# EAGLE board riser-v2 (EAGLE 7.7.0)
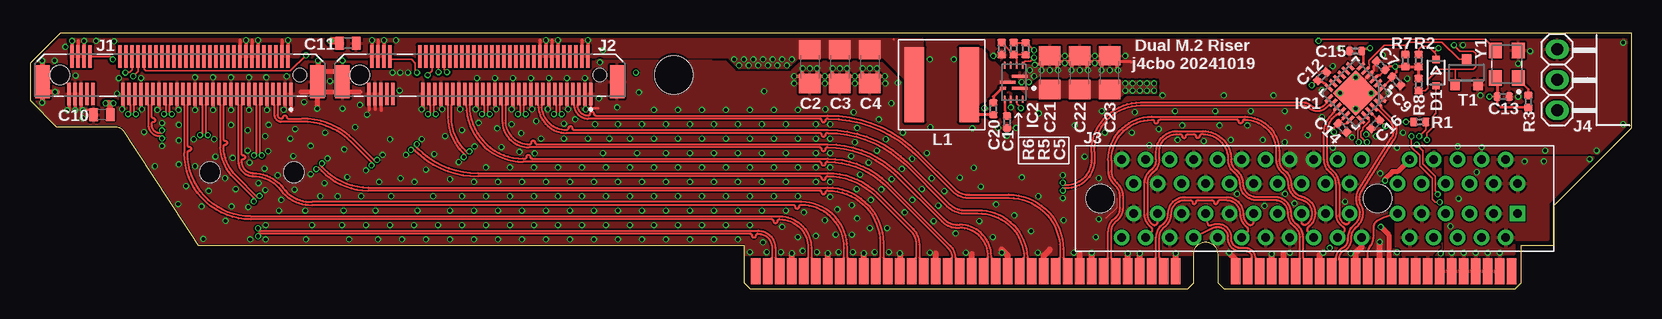
[diagram p4: board, top side]
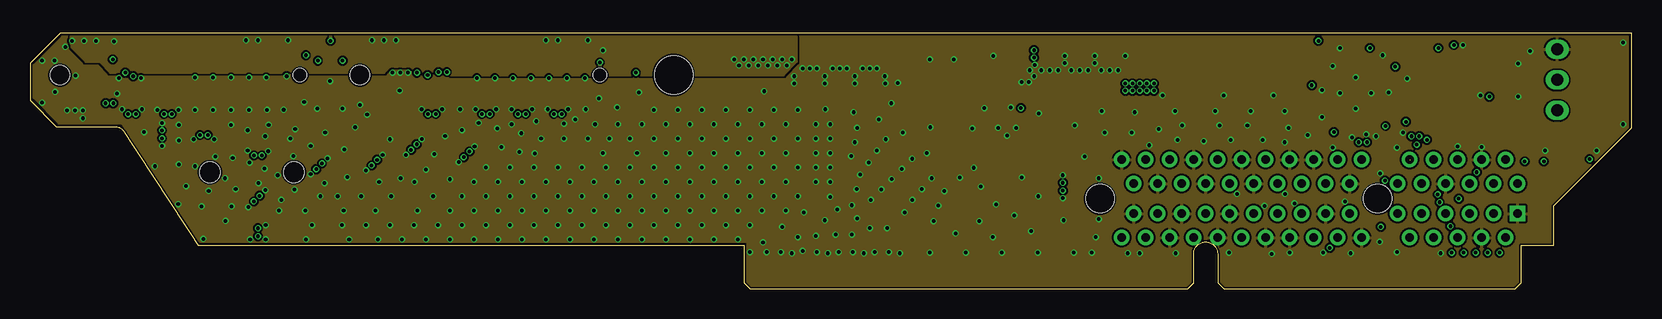
[diagram p5: board, inner layer Route2]
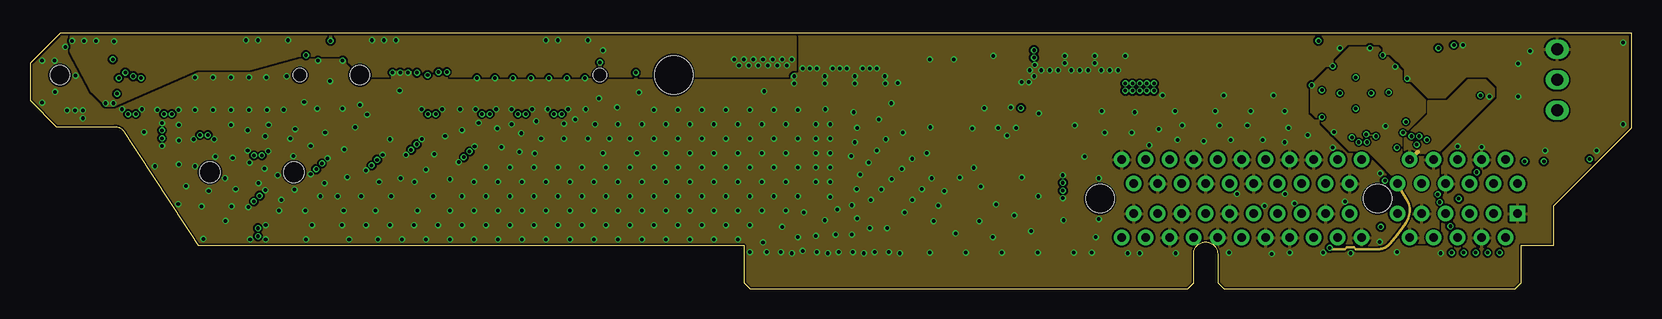
[diagram p6: board, inner layer Route15]
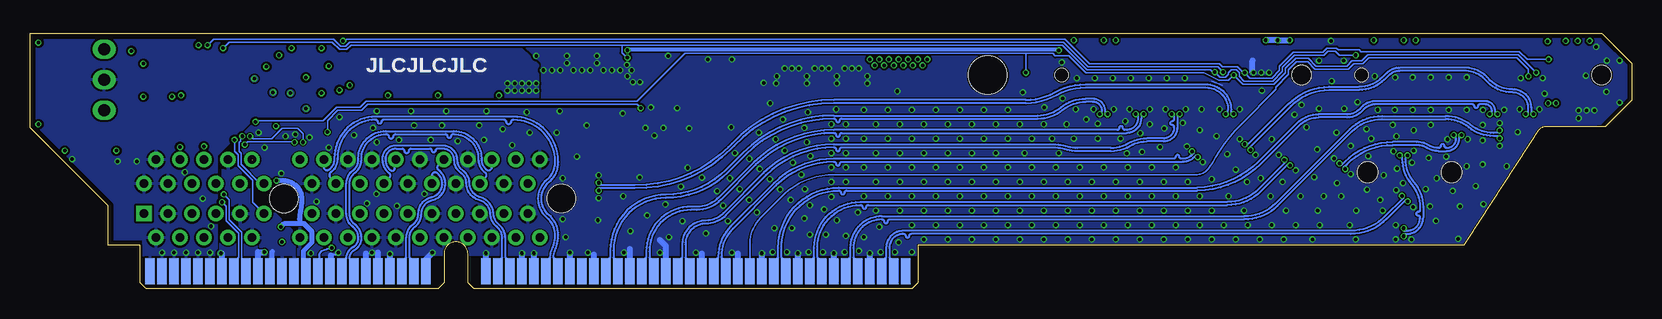
[diagram p7: board, bottom side, seen from below]

Size 133.5 x 21.3 mm. Coordinates in mm from the lower left corner, seen from the top.
Outline: 14,3.6 59.5,3.6 59.5,0.5 60,0 96.5,0 97,0.5 97,2.9 arc-90 98,3.9 arc-90 99,2.9 99,0.5 99.5,0 123.8,0 124.3,0.5 124.3,3.6 127,3.6 127,6.9 133.5,13.4 133.5,21.3 2.5,21.3 0,18.8 0,15.7 2.2,13.5 7.1,13.5 arc-60 7.9,13 14,3.6
Copper layers (1+2*15+16): Top 0.035mm / dielectric 0.2mm / Route2 0.035mm / dielectric 0.15mm / Route15 0.035mm / dielectric 0.2mm / Bottom 0.035mm
Design rules "default *": minimum track width 3.5mil, minimum drill 0.3mm, track to track 4mil, track to pad 4mil, pad to pad 4mil, via to via 4mil, smd to smd 0.05mm, copper to edge 0.1mm, drill to drill 8mil, minimum pad ring 0.3mm, minimum via ring 0.1mm, stop-mask expansion 0.03048125mm, vias tented up to drill 20mil, thermal gap 7mil
Net classes: 1 pcie: width 0.158 mm, clearance 0.102 mm
Holes 3.2 mm at 53.65,17.8
Holes 1.7 mm at 22,9.7 15,9.7

## Footprints (pad centres in the part's own frame; a part is rotated, then mirrored left to right if it is on the bottom)
C0402 = smd 0.6 x 0.7: 1 -0.5,0; 2 0.5,0
C1206 = smd 1.6 x 1.8: 1 -1.4,0; 2 1.4,0
C0603 = smd 0.8 x 1.1: 1 -0.7,0; 2 0.7,0
SOD323-R = smd 0.6 x 0.6: A 1.1,0; C -1.1,0
QFN24_4X4_SIL = smd 0.813 x 0.254: 1 -1.892,1.25; 2 -1.892,0.75; 3 -1.892,0.25; 4 -1.892,-0.25; 5 -1.892,-0.75; 6 -1.892,-1.25; 13 1.892,-1.25; 14 1.892,-0.75; 15 1.892,-0.25; 16 1.892,0.25; 17 1.892,0.75; 18 1.892,1.25 | smd 0.254 x 0.813: 7 -1.25,-1.892; 8 -0.75,-1.892; 9 -0.25,-1.892; 10 0.25,-1.892; 11 0.75,-1.892; 12 1.25,-1.892; 19 1.25,1.892; 20 0.75,1.892; 21 0.25,1.892; 22 -0.25,1.892; 23 -0.75,1.892; 24 -1.25,1.892 | smd 2.692 x 2.692: 25 0,0
VREG_TPS51386RJNR = smd 1.4 x 0.25: 1 -0.5,0.5; 2 -0.5,-0.5; 7 0.5,0 | smd 0.25 x 0.6: 3 -0.75,-1.4; 4 -0.25,-1.4; 5 0.25,-1.4; 6 0.75,-1.4; 9 0.75,1.4; 10 0.25,1.4; 11 -0.25,1.4; 12 -0.75,1.4 | smd 0.6 x 0.25: 8 0.9,0.5
MDT350M01001VT_EXT = smd 0.3 x 1.875: 1 9.25,-1.562; 2 9,1.562; 3 8.75,-1.562; 4 8.5,1.562; 5 8.25,-1.562; 6 8,1.562; 7 7.75,-1.562; 8 7.5,1.562; 9 7.25,-1.562; 10 7,1.562; 11 6.75,-1.562; 12 6.5,1.562; 13 6.25,-1.562; 14 6,1.562; 15 5.75,-1.562; 16 5.5,1.562; 17 5.25,-1.562; 18 5,1.562; 19 4.75,-1.562; 20 4.5,1.562; 21 4.25,-1.562; 22 4,1.562; 23 3.75,-1.562; 24 3.5,1.562; 25 3.25,-1.562; 26 3,1.562; 27 2.75,-1.562; 28 2.5,1.562; 29 2.25,-1.562; 30 2,1.562; 31 1.75,-1.562; 32 1.5,1.562; 33 1.25,-1.562; 34 1,1.562; 35 0.75,-1.562; 36 0.5,1.562; 37 0.25,-1.562; 38 0,1.562; 39 -0.25,-1.562; 40 -0.5,1.562; 41 -0.75,-1.562; 42 -1,1.562; 43 -1.25,-1.562; 44 -1.5,1.562; 45 -1.75,-1.562; 46 -2,1.562; 47 -2.25,-1.562; 48 -2.5,1.562; 49 -2.75,-1.562; 50 -3,1.562; 51 -3.25,-1.562; 52 -3.5,1.562; 53 -3.75,-1.562; 54 -4,1.562; 55 -4.25,-1.562; 56 -4.5,1.562; 57 -4.75,-1.562; 58 -5,1.562; 67 -7.25,-1.562; 68 -7.5,1.562; 69 -7.75,-1.562; 70 -8,1.562; 71 -8.25,-1.562; 72 -8.5,1.562; 73 -8.75,-1.562; 74 -9,1.562; 75 -9.25,-1.562 | smd 1.2 x 2.75: S1 -11.45,-0.55; S2 11.45,-0.55 | hole 1.1: 10,0 | hole 1.6: -10,0
PCI-E-X4 = drill 0.7 pad 1.27 square: A1 -17,1.25 | drill 0.7 pad 1.27: A2 -16,3.25; A3 -15,1.25; A4 -14,3.25; A5 -13,1.25; A6 -12,3.25; A7 -11,1.25; A8 -10,3.25; A9 -9,1.25; A10 -8,3.25; A11 -7,1.25; A12 -4,3.25; A13 -3,1.25; A14 -2,3.25; A15 -1,1.25; A16 0,3.25; A17 1,1.25; A18 2,3.25; A19 3,1.25; A20 4,3.25; A21 5,1.25; A22 6,3.25; A23 7,1.25; A24 8,3.25; A25 9,1.25; A26 10,3.25; A27 11,1.25; A28 12,3.25; A29 13,1.25; A30 14,3.25; A31 15,1.25; A32 16,3.25; B1 -17,-1.25; B2 -16,-3.25; B3 -15,-1.25; B4 -14,-3.25; B5 -13,-1.25; B6 -12,-3.25; B7 -11,-1.25; B8 -10,-3.25; B9 -9,-1.25; B10 -8,-3.25; B11 -7,-1.25; B12 -4,-3.25; B13 -3,-1.25; B14 -2,-3.25; B15 -1,-1.25; B16 0,-3.25; B17 1,-1.25; B18 2,-3.25; B19 3,-1.25; B20 4,-3.25; B21 5,-1.25; B22 6,-3.25; B23 7,-1.25; B24 8,-3.25; B25 9,-1.25; B26 10,-3.25; B27 11,-1.25; B28 12,-3.25; B29 13,-1.25; B30 14,-3.25; B31 15,-1.25; B32 16,-3.25 | hole 2.35: -5.35,0; 17.8,0
1X03 = drill 1.016 long: 1 -2.54,0; 2 0,0; 3 2.54,0
ADDR0262-EDGE = smd 0.8 x 2.2: A1 1,1.1; A2 2,1.1; A3 3,1.1; A4 4,1.1; A5 5,1.1; A6 6,1.1; A7 7,1.1; A8 8,1.1; A9 9,1.1; A10 10,1.1; A11 11,1.1; A12 12,1.1; A13 13,1.1; A14 14,1.1; A15 15,1.1; A16 16,1.1; A17 17,1.1; A18 18,1.1; A19 19,1.1; A20 20,1.1; A21 21,1.1; A22 22,1.1; A23 23,1.1; A24 24,1.1; A25 25,1.1; A26 26,1.1; A27 27,1.1; A28 28,1.1; A29 29,1.1; A30 30,1.1; A31 31,1.1; A32 32,1.1; A33 33,1.1; A34 34,1.1; A35 35,1.1; A36 36,1.1; A37 41,1.1; A38 42,1.1; A39 43,1.1; A40 44,1.1; A41 45,1.1; A42 46,1.1; A43 47,1.1; A44 48,1.1; A45 49,1.1; A46 50,1.1; A47 51,1.1; A48 52,1.1; A49 53,1.1; A50 54,1.1; A51 55,1.1; A52 56,1.1; A53 57,1.1; A54 58,1.1; A55 59,1.1; A56 60,1.1; A57 61,1.1; A58 62,1.1; A59 63,1.1; A60 64,1.1 | smd 0.8 x 2.2 bottom: B1 1,1.1; B2 2,1.1; B3 3,1.1; B4 4,1.1; B5 5,1.1; B6 6,1.1; B7 7,1.1; B8 8,1.1; B9 9,1.1; B10 10,1.1; B11 11,1.1; B12 12,1.1; B13 13,1.1; B14 14,1.1; B15 15,1.1; B16 16,1.1; B17 17,1.1; B18 18,1.1; B19 19,1.1; B20 20,1.1; B21 21,1.1; B22 22,1.1; B23 23,1.1; B24 24,1.1; B25 25,1.1; B26 26,1.1; B27 27,1.1; B28 28,1.1; B29 29,1.1; B30 30,1.1; B31 31,1.1; B32 32,1.1; B33 33,1.1; B34 34,1.1; B35 35,1.1; B36 36,1.1; B37 41,1.1; B38 42,1.1; B39 43,1.1; B40 44,1.1; B41 45,1.1; B42 46,1.1; B43 47,1.1; B44 48,1.1; B45 49,1.1; B46 50,1.1; B47 51,1.1; B48 52,1.1; B49 53,1.1; B50 54,1.1; B51 55,1.1; B52 56,1.1; B53 57,1.1; B54 58,1.1; B55 59,1.1; B56 60,1.1; B57 61,1.1; B58 62,1.1; B59 63,1.1; B60 64,1.1
DFN750X725X700-2N = smd 6.23 x 1.63: 1 0,-2.285; 2 0,2.285
R0402 = smd 0.6 x 0.7: 1 -0.5,0; 2 0.5,0
SOT23-3 = smd 0.8 x 0.9: 1 -0.95,-1; 2 0.95,-1; 3 0,1.1
OSC_ECS-327KE-TR = smd 1.3 x 1.1: 1 -1.15,-0.95; 2 1.15,-0.95; 3 1.15,0.95; 4 -1.15,0.95

## Placement (x,y rotation side)
C1  1uF  [C0402]  81.45,13.9 270 top
C2  47uF 10V  [C1206]  65,18.5 270 top
C3  47uF 10V  [C1206]  67.5,18.5 270 top
C4  47uF 10V  [C1206]  70,18.5 270 top
C5  DNP  [C0402]  83,20 270 top
C7  0.1uF  [C0402]  112.6,18.6 135 top
C9  0.1uF  [C0402]  113.9,17.3 315 top
C10  10uF 10V  [C0603]  6,14.5 180 top
C11  10uF 10V  [C0603]  26.5,20.45 180 top
C12  0.1uF  [C0402]  107.7,17.7 45 top
C13  0.1uF  [C0402]  122.8,16 0 top
C14  0.1uF  [C0402]  109.4,13.4 315 top
C15  0.1uF  [C0402]  110.5,19.8 180 top
C16  0.1uF  [C0402]  112.15,13.7 225 top
C20  0.1uF  [C0402]  80.3,15 270 top
C21  10uF 25V  [C1206]  85,18 90 top
C22  10uF 25V  [C1206]  87.5,18 90 top
C23  10uF 25V  [C1206]  90,18 90 top
D1  1N5819  [SOD323-R]  117.2,18 270 top
IC1  SI53152-A01AGM  [QFN24_4X4_SIL]  110.5,16.3 225 top
IC2  TPS51386RJNR  [VREG_TPS51386RJNR]  82,17.2 180 top
J1  MDT350M01001VTEXT  [MDT350M01001VT_EXT]  12.5,17.8 0 top
J2  MDT350M01001VTEXT  [MDT350M01001VT_EXT]  37.5,17.8 0 top
J3  PCI-E-X4  [PCI-E-X4]  107,7.5 180 top
J4  0022053031  [1X03]  127.3,17.4 270 top
JP1  ADDR0262  [ADDR0262-EDGE]  59.5,0.35 0 top
L1  XAL7070-182MEC  [DFN750X725X700-2N]  76,17 90 top
R1  DNP  [R0402]  115.85,13.9 0 top
R2  10k  [R0402]  115.75,19 270 top
R3  2.2k  [R0402]  124.9,15.6 270 top
R5  10k  [R0402]  82,20 90 top
R6  2.2k  [R0402]  81,20 90 top
R7  10k  [R0402]  114.65,19 270 top
R8  10k  [R0402]  115.75,17 90 top
T1  2N7002  [SOT23-3]  119.75,18 0 top
Y1  ECS-327KE-TR  [OSC_ECS-327KE-TR]  123.1,18.7 90 top

## Tracks (layer width: path | path; a pad name or v marks a point on that pad's centre or on a via)
+3V3  (via drill 0.3)
  Top 0.12: 113.9,18.03 113.93,18 | v82.6,15.05 82.25,15.4 IC2.11 | IC1.18 109.72,13.75 C14.1 | C12.1 107.35,17.4
  Top 0.2: IC1.12 107.93,17.1 107.85,17.1 107.6,17.35 C12.1 107.25,17.35 v106.85,16.95 | IC1.17 109.05,13.79 C14.1 108.7,13.41 v108.7,13.04 | IC1.3 112.35,17.8 112.51,17.8 C7.1 113,18.25 113.3,18.55 113.8,18.55 v113.8,18.5 113.9,18.5 113.9,18.03 113.55,17.68 C9.1 113.55,17.58 IC1.1 | IC1.21 112.39,14.05 C16.1 v113,13.55 | 111.15,19.8 111.15,20 111.65,20 v111.7,20.05 | IC1.6 111.15,18.72 111.15,19.8 | 111.15,19.8 C15.1
  Top 0.24: v113.8,18.5 R7.2 R2.2 R8.2
  Bottom 0.12: v82.6,15.05 82.9,15.35 105.35,15.35 105.85,14.85 107.85,14.85 108.7,14 v108.7,13.04
  Bottom 0.4: JP1.B50 113.3,1.45 113.3,3.1
  pour Bottom: 111.5,2.2 113.5,2.2 113.5,2.7 117.4,6.6 117.4,10.9 117.2,11.1 116,11.1 114.5,9.6 114.5,7.6 111.5,4.6
  pour Top: 114.3,2.05 113.9,2.45 113.9,9 116.25,11.35 117.5,11.35 117.5,3.55 116.8,2.85 116.8,2.05
  pour Route15 (isolate 0.12): 106.8,14.7 106.8,16.9 110,20.1 112.35,20.1 114.3,18.15 114.3,17.7 116.25,15.75 116.25,14.65 114.3,12.7 114.3,10.7 114.7,10.3 115.1,10.3 115.8,11 117.4,11 117.4,4 117.2,3.8 114.7,3.8 114.7,8.3 111.5,11.5 110,11.5
+12V  (via drill 0.3)
  other vias: 119.5,3 119.1,7.5 124.6,10.6 122.5,3 121.5,3 118.5,3 120.5,3 126.2,10.6 118.4,5.2 120.6,9.7 130,10.8 91.3,17.1 91.9,17.1 92.5,17.1 93.1,17.1 91.3,16.5 91.9,16.5 92.5,16.5 93.1,16.5 93.7,16.5 93.7,17.1
  pour Bottom (isolate 0.18): 117.9,2.1 117.9,11.1 114.9,14.1 108.8,14.1 108,14.9 106.1,14.9 105.5,15.5 91.1,15.5 91.1,18.6 93.3,20.8 126.5,20.7 133,20.7 133,13.6 126.5,7.1 126.5,4.1 124.1,4.1 124.1,2.1
  pour Top: 123.7,2.9 123.7,4.1 126.5,4.1 126.5,7.1 130.3,10.9 118,10.9 118,3.3 117.5,2.8 117.5,0.9 122.7,0.9 122.7,2.9
  pour Top (no thermals): 81.9,16.75 83.45,16.75 84,17.3 93.9,17.3 93.9,16.3 91.2,16.3 90.8,15.9 83.3,15.9 82.55,16.65 81.9,16.65
BOOT
  Top 0.24: IC2.8 81,16.7 80.3,16 C20.1
BUCK_VCC
  Top 0.2: IC2.9 81.25,14.85 81.3,14.8 81.3,14.4 C1.1
CLKBUF_OE_DIFF0
  Top 0.12: IC1.5 111.65,18.51 111.65,18.7 111.6,18.75 111.6,19 112.9,20.3 114.65,20.3 | R7.1 114.65,20.3 | 114.65,20.3 114.9,20.55 117.7,20.55 119.15,19.1 T1.3
FB
  Top 0.16: R6.2 R5.1 82.25,19.5 | C5.2 82.25,19.5 | IC2.4 82.25,19.5
GND  (via drill 0.3)
  Top 0.1: 90.61,7.55 90.61,6.75 89.71,5.85 89.7,5.85
  Top 0.12: J1.1 21.75,16.19 21.75,15 21.65,14.9 | 112.5,16.05 112.25,16.3 v111.8,16.3 | IC1.4 111.1,17.25
  Top 0.158: 24,17.8 24,18.1
  Top 0.2: IC1.4 112,18.15 112,18.55 112.25,18.8 C7.2 | IC1.25 v111.8,16.3 | 46.75,16.44 46.75,15.05 | 46.75,15.05 47.35,15.05 | 46.75,15.05 46.3,15.05 | 5.35,14.9 4.4,14.9 v4.4,14.85
  Top 0.24: v84.3,18.2 84.4,18.2 84.4,18.8 | 85.6,18.2 85.6,18.8 | 86.9,18.2 86.9,18.8 | 88.1,18.2 88.1,18.8 | 89.4,18.2 89.4,18.8 | 90.6,18.2 90.6,18.8 | 91.8,18.9 84.25,18.9 84.05,18.7 83.75,18.7 v83.75,18.65
  Top 0.3: J1.73 v3.75,14.85 | J1.75 3.25,14.85 v3.1,14.85 | J1.71 4.25,14.85 v4.4,14.85 | J1.3 21.25,14.91 v21.15,14.91 | J1.9 v19.75,14.9 | J1.15 v18.25,14.9 | J1.21 v16.75,14.9 | J1.57 7.75,14.85 | J1.51 9.25,14.85 | J1.45 10.75,14.85 | J1.39 12.25,14.85 | 13.75,16.29 v13.75,14.9 | 15.25,16.29 v15.25,14.9 | 21.75,16.19 21.75,14.8 | 28.25,16.29 28.25,14.9 | 28.75,16.34 28.75,14.95 | J2.71 29.25,14.85 | J2.57 32.75,14.85 | J2.51 34.25,14.85 | 35.75,16.34 35.75,14.95 | J2.39 37.25,14.85 | J2.33 38.75,14.85 | J2.27 40.25,14.85 | J2.21 41.75,14.85 | J2.15 43.25,14.85 | J2.9 44.75,14.85 | J2.3 46.25,14.85 | v63.7,17.7 64.4,17.7 | 64.4,17.7 65.6,17.7 | 65.6,17.7 66.9,17.7 | 66.9,17.7 68.1,17.7 | 68.1,17.7 69.4,17.7 | 69.4,17.7 70.6,17.7 | 70.6,17.7 v71.25,17.7 | v64.4,18.35 64.4,17.7 | v65.6,18.35 65.6,17.7 | v66.9,18.35 66.9,17.7 | v68.1,18.35 68.1,17.7 | v69.4,18.35 69.4,17.7 | v70.6,18.35 70.6,17.7
  Top 0.4: J1.S2 v23.95,15 | v24,19 24,18.1 | 24,18.1 24,17 | J1.S1 1.4,17.25 | 1,16.75 v1,15.5 | v1,19 1,16.8 | 24,18.1 25.8,18.1 | 22.6,16.4 27.5,16.4 | 1.05,16.4 2.3,16.4
  Top 0.5: JP1.A40 v103.5,2.9 | JP1.B41 104.5,2.95 | JP1.A44 107.5,2.8 | JP1.A47 110.5,3 111,3.5 | JP1.A36 v95.5,2.95 | JP1.A29 v88.5,3 | JP1.A25 84.5,2.75 85,3.25 | JP1.A22 81.5,2.75 81,3.25 | JP1.A19 78.5,2.9 | JP1.A28 87.5,2.9 | JP1.A49 v112.5,3.9 | JP1.A16 75.5,2.95 | JP1.A4 v63.5,2.95 | JP1.A7 v66.5,2.95 | JP1.A10 v69.5,2.95 | v72.5,2.95 JP1.A13 | JP1.A37 100.5,2.45 v99.95,3 | JP1.A32 v91.5,2.95 | JP1.A33 v92.5,2.95
  Top 0.6: C11.2 25.8,20.65 v25.05,20.65
  Bottom 0.12: 34.1,16.95 35,17.3
  Bottom 0.158: 108.4,2.75 108.4,2.85 107.8,2.85 v107.8,3
  Bottom 0.5: JP1.A40 v103.5,2.9 | JP1.B42 105.5,2.95 | JP1.A37 100.5,2.45 v99.95,3 | JP1.B45 108.4,1.45 108.4,2.75 | JP1.A36 v95.5,2.95 | JP1.A29 v88.5,3 | JP1.B24 83.5,3.3 | JP1.B21 80.5,3.55 81,4.05 | JP1.B18 77.5,2.95 | JP1.B27 86.5,2.85 | JP1.B15 74.5,2.95 | JP1.A4 v63.5,2.95 | JP1.A7 v66.5,2.95 | JP1.A10 v69.5,2.95 | JP1.A13 v72.5,2.95 | JP1.A32 v91.5,2.95 | JP1.A33 v92.5,2.95 | JP1.B51 114.5,3.05 v113.95,3.05 | JP1.B54 117.5,2.95 v117.6,2.95 | JP1.B41 104.5,3 | 31.6,18 31.6,19
  other vias: 87,3 75,3 19.7,17.6 7.25,16.25 12.38,14.9 10.62,14.9 9.33,14.95 7.68,14.95 73.53,10.82 66.3,14.95 50.75,16.35 3.8,17.75 7.4,17.55 12.35,7.05 61.1,3.85 59,4.1 95.65,12.4 96.05,13.6 97.85,12.3 100.1,12.4 101.48,13.6 104.6,12.2 106.5,12.8 107.7,14.3 104.61,7.9 22.85,15.55 9.5,13.05 12.4,10.35 27.1,13.45 29.4,11.15 9.25,17.55 58,5.3 59,6.5 30,12.45 23,4.1 26.6,4.1 23.5,5.3 58,7.7 59,8.9 40,10.1 40.8,11.4 40.95,12.95 66.7,8.9 66.7,10.1 66.7,11.3 66.7,12.5 49,13.7 44.85,14.95 46.33,14.95 34.35,14.95 35.85,14.95 37.15,14.95 38.85,14.95 40.15,14.95 41.85,14.95 43.15,14.95 35.74,10.54 37.06,11.86 31.34,11.14 32.66,12.46 32.65,14.95 102.91,6.9 100.61,7.9 70.1,7.4 71.83,9.12 81,3 72.9,6.35 72.67,9.97 45.45,14.1 19.85,11.45 24.2,7.7 18.15,11.5 23.4,9.55 24.8,10.85 37.25,17.55 38.75,17.55 40.25,17.55 41.75,17.55 43.25,17.55 44.75,17.55 46.25,17.55 70.97,8.28 84.1,14.6 87.1,13.6 70.75,14.1 74.75,11.3 60,3.05 78,3 84,3 105,3 110.1,2.95 108.6,11.75 107.7,16.55 112.75,19.45 113.25,16.35 113.95,11.75 76.22,8.12 75.72,6.92 75.33,5.62 79.12,5.62 80.53,7.03 78.67,10.07 92.1,14.7 89.6,13 86.1,7.55 105.41,7.1 110.2,12.6 112.2,12.7 109.2,16.3 110.5,17.6 110.5,15 111.39,12.86 114.45,13 124.05,16 109.2,20.05 114.8,17.5 109.61,7.25 112.55,9.6 26.05,19 25,17.3 26.05,15 2.05,19 2.95,20.15 66.7,13.7 64,7.7 68.95,5.85 61.2,16.45 62.7,5.15 64.5,6.35 66.7,7.65 58,10.1 59,11.3 58,12.5 59,13.7 58,14.9 98.8,14.8 104.6,14.8 89.1,9.2 89.1,5.8 48.3,12.5 47.75,11.3 48,10.1 49,8.9 48,7.7 49,6.5 48,5.3 49,4.1 41,8.9 40,7.7 41,6.5 40,5.3 41,4.1 33.6,7.7 30.9,9.2 30,5.3 31,4.1 27.51,15.31 14.45,4.15 89.35,14.8 104.9,13.4 93.3,11.95 94.1,13.3 11,13.8 16.75,13.65 19.6,12.7 15.35,12.45 19.9,13.65 18.15,13.2 28,9.85 11,11.9 13.65,12.45 17.15,8.3 19.62,8.22 18.2,6.79 16.9,10.9 19.65,4.1 19.65,5.3 18.3,10.5 18.35,4.1 43,4.1 45,4.1 47,4.1 46,5.3 47,6.5 46,7.7 47,8.9 44,5.3 45,6.5 44,7.7 45,8.9 43,8.9 42,7.7 43,6.5 42,5.3 42,10.1 44,10.1 46,10.1 56,14.9 54,14.9 52,14.9 48.95,15.1 40.15,13.7 38.95,13.35 39.3,11.8 38,10.1 37,8.9 39,8.9 38,7.7 36,7.7 37,6.5 36,5.3 37,4.1 39,4.1 38,5.3 39,6.5 36,13.22 37.4,13.82 34.6,12.72 35,9.12 33,9.92 33.7,11.22 35,6.5 32.3,6.5 32,5.3 33,4.1 34,5.3 35,4.1 51,13.7 50,12.5 50.6,11.3 50,10.1 51,8.9 50,7.7 51,6.5 50,5.3 51,4.1 53,13.7 52,12.5 53,11.3 52,10.1 53,8.9 52,7.7 53,6.5 52,5.3 53,4.1 55,13.7 54,12.5 55,11.3 54,10.1 55,8.9 54,7.7 55,6.5 54,5.3 55,4.1 57,13.7 56,12.5 57,11.3 56,10.1 57,8.9 56,7.7 57,6.5 56,5.3 57,4.1 60,5.3 61,6.5 60,7.7 61,8.9 60,10.1 61,11.3 60,12.5 61,13.7 60,14.9 62,14.9 63,13.7 62,12.5 63,11.3 62,10.1 63,8.9 62,7.7 63,6.5 64,4.3 65.5,4.4 67.15,4.5 68.5,4.5 66.25,5.7 67.3,6.6 68.5,6.95 70,5.05 70.4,3.05 68.6,3.05 67.4,3.05 65.6,3.05 64.4,3.15 62.6,3.05 61.4,3.05 71.6,3.05 71.45,5.05 68.9,8.3 69.2,9.5 68.45,11.05 69.9,10.5 68.75,12.2 70.59,11.5 71.35,12.45 68.95,13.4 68.65,14.7 72.75,13 73.55,7.4 74.35,8.3 75.15,9.2 77.5,9.25 65.5,12.5 65.5,13.7 64,14.9 65.5,11.3 65.5,10.1 65.5,8.9 77.15,4.6 80.25,4.3 82.05,6.1 83.45,4.8 86.15,5.7 88.85,4.3 99.15,13.6 91.85,13 95.45,14.8 101.75,14.8 103.65,16.1 30.1,7.7 29.1,8.9 27.6,7.7 28.8,6.5 29,4.1 12.4,13.65 12.4,12.35 13,8.55 14.3,6.85 16.3,5.65 16.8,6.85 14.9,8.15 13.75,10.2 15.45,11 16.25,9.2 19.05,8.8 22.95,6.5 20.95,7.4 20.75,6.5 26.15,6.5 26,5.3 28,5.3 25.65,7.7 24.55,8.8 22.05,8.25 20.65,9.45 19.55,10 21.95,11.05 21.7,12.5 22.1,13.3 23.4,11.9 24.6,13 26.2,11.6 28.1,14.5 26.45,9.3 10.4,10.2 16.75,17.6 13.75,17.6 15.25,17.6 18.25,17.6 21.4,17.7 64,10.1 64,12.5 2.1,16.4 99.5,16.1 94.4,16.1 86.1,9.45 79.25,8.5 84.05,7.7 132.8,20.5 126.3,11.5 125.05,19.8 108.6,18.55 32.05,8.9 30.81,16.51 30.86,18.01 30.21,18.01 31.51,18.01 47.5,18.85 120.9,16.1 71.8,15.45 121,11.8 119,11.85 130.6,11.5 124.05,18.75 47.43,15.85 44.5,13.75 42.2,13.95 42.6,12.5 44.5,12.5 46.5,12.5 47.1,13.7 102.75,12.4 119.45,20.3 81.75,15.1 82.65,17.22 83.7,17.7 83.35,18.2 65,18.35 67.5,18.35 70,18.35 83.25,17.22 82.2,13.4 80.7,13.4 81.45,12.75 80.3,19.4 85,18.2 85.7,18.2 87.5,18.2 86.8,18.2 88.2,18.2 89.3,18.2 90,18.2 90.7,18.2 86.25,19.4 88.75,19.4 91.3,19.4 79.55,15.05 75.05,13.45 72.35,17.15 77,19.1 78.55,13.35 82.67,9.28 87.9,11 71.3,17.1 68.75,17.1 66.25,17.1 63.7,17.1 4.4,14.2 86.25,18.8 88.75,18.8 132.8,13.7 42.08,11.27 75,19.1 66.25,17.7 68.75,17.7
  pour Route2 (isolate 0.16, rank 2): 133.2,21 133.2,0 59.8,0 59.8,3.9 14.2,3.9 7.7,13.8 2.4,13.8 0.3,15.9 0.3,18.6 2.7,21
  pour Bottom (isolate 0.102, rank 2): 3,14.5 3,2.8 117.8,2.8 117.8,20.8 114.9,20.8 109.1,15 77,15 75.5,16.5 29,16.5 26.5,19 10.6,19 6.1,14.5
  pour Top (isolate 0.102, rank 2): 126.5,11 126.5,2.8 0.5,2.8 0.5,15.1 47.2,15.1 47.2,20.8 56.8,20.8 56.8,15 71,15 76.5,9.5 85.5,9.5 87.5,11.5 87.5,13 90,15.5 91,15.5 91.5,16 94.4,16 94.4,20.8 101.5,20.8 106.7,15.6 107.7,15.6 108.8,14.5 108,13.7 109.6,12.1 112.95,12.1 112.95,15.05 117,11
  pour Top (no thermals): 96.6,7.25 95.8,7.25 94.9,6.35 94.9,5.55 95.4,5.55 95.4,6.05 96.4,7.05 96.6,7.05
  pour Top (no thermals): 98.2,5.25 99.2,5.25 100.1,4.35 99.8,3.55 99.7,3.55 99.5,3.7 98.9,3.7 98,4.35
  pour Top (no thermals): 95.1,5.45 94.7,5.45 93.8,4.55 93.8,3.45 94.45,3.45 94.45,3.8 94.6,3.95 95.1,3.95
  pour Top (no thermals): 101.2,5.45 101.2,6.25 100.3,7.15 99,7.15 99,6.9 99.6,6.9 100.6,5.8 100.6,5.45
  pour Top (no thermals): 92.8,5.35 92.8,7.25 92.5,7.25 92.5,6.95 92.2,6.55 91.8,6.55 91.8,6.15 92.2,6.15 92.6,5.75 92.6,5.35
  pour Top (no thermals): 90.9,7.25 90.9,5.35 91.2,5.35 91.2,5.85 91.4,6.05 92.3,6.05 92.3,6.45 91.9,6.45 91.5,6.85 91.5,7.25
  pour Top (no thermals): 90.3,11.7 90.3,9.85 90.6,9.85 90.6,10.15 90.9,10.55 91.3,10.55 91.3,10.95 91,10.95 90.6,11.35 90.6,11.75
  pour Top (no thermals): 105.9,9.85 105.9,11.75 105.1,11.75 105.1,11.25 105.4,11.05 104.5,11.05 104.5,10.65 105.2,10.65 105.6,10.25 105.6,9.85
  pour Top (no thermals): 106.2,11.75 106.2,9.75 107.1,9.75 107.1,10.55 107.6,10.55 107.6,10.95 106.7,10.95 106.4,11.25 106.4,11.75
  pour Top (no thermals): 107,7.25 107,5.35 107.4,5.35 107.4,5.85 107.6,6.05 108.4,6.05 108.4,6.45 107.9,6.45 107.4,6.95 107.4,7.25
  pour Top (isolate 0.2, no thermals): 91,9.45 91,7.55 91.4,7.55 91.4,8.25 92.1,8.25 92.1,9.45
  pour Top (no thermals): 93.2,9.75 93.2,7.85 93.5,7.85 93.5,8.25 93.8,8.55 94.1,8.55 94.1,9.75
  pour Top (no thermals): 104.35,11.05 104.35,9.65 105.1,9.65 105.1,11.05
  pour Top (no thermals): 104.25,11.6 104.25,10.75 104.5,10.75 104.5,12.15
  pour Top (no thermals): 99.9,11.45 99.9,10.35 101,9.25 101,8.25 101.6,7.65 102.6,7.65 102.6,7.95 102.3,7.95 102.3,9.05 101.6,9.05 101.3,9.35 101.3,9.65 101,9.95 101,10.85 100.4,11.45
  pour Top (no thermals): 103.7,7.25 103.7,6.65 104.6,6.65 104.6,7.25
  pour Top (no thermals): 104.8,4.15 105,4.15 105.5,3.65 105.5,3.45 105.7,3.45 105.7,5.25 104.8,5.25
  pour Top (no thermals): 97.8,8.85 98.1,8.85 98.1,7.95 98.7,7.95 98.7,7.65 97.2,7.65 97.2,7.95 97.8,7.95
  pour Route15 (isolate 0.16, rank 2): 133.2,21 133.2,0.1 0.25,0 0.3,18.65 2.65,21
  pour Top (no thermals): 99.7,6.45 100.1,6.45 100.1,5.15 98,5.15 98,5.75 99.7,5.75
  pour Bottom (isolate 0.102, no thermals): 102.2,4.9 102.2,3.4 102.4,3.4 102.4,3.7 102.6,3.9 103.3,3.9 103.3,4.5 102.5,4.5 102.5,4.6 102.3,4.8 102.3,4.9
  pour Bottom (isolate 0.102, no thermals): 100.8,5.5 100.8,7 100.6,7 100.6,6.7 100.4,6.5 99.7,6.5 99.7,5.9 100.5,5.9 100.5,5.8 100.7,5.6 100.7,5.5
  pour Bottom (isolate 0.102, no thermals): 100.8,5.5 100.8,7 100,7.3 99.7,7.3 99.7,6 100.5,5.9 100.5,5.8 100.7,5.6 100.7,5.5
  pour Bottom (isolate 0.102, no thermals): 98.9,8 98.9,9.5 98.6,9.5 98.6,9.2 98.4,9 97.8,9 97.8,8.4 98.6,8.4 98.6,8.2 98.8,8
  pour Bottom (isolate 0.102, no thermals): 95,7 95,5.5 95.3,5.5 95.3,5.7 95.5,5.9 96.1,6 96.1,7 96.2,7.1 96.5,7.1 96.5,7.3 95.4,7.3 95.1,7
  pour Bottom (isolate 0.102, no thermals): 94.1,4.9 94.1,3.4 94.4,3.4 94.4,3.8 94.5,3.9 95.2,3.9 95.2,4.5 95,4.5 95,5.2 94.2,5.1 94.2,4.9
  pour Bottom (isolate 0.102, no thermals): 97,9.4 97,7.9 97.3,7.9 97.3,8.1 97.5,8.3 98.1,8.4 98.1,9.7 97.4,9.7 97.1,9.4
  pour Bottom (isolate 0.102, no thermals): 107.2,7.2 107.2,5.5 107.4,5.5 107.4,5.8 107.6,6 108.3,6 108.3,6.6 107.6,6.6 107.4,6.8 107.4,7.1 107.3,7.2
  pour Bottom (no thermals): 90.9,6.2 90.9,7.1 91.2,7.1 91.6,6.7 92.3,6.7 92.3,6.2
  pour Bottom (isolate 0.102, no thermals): 97.8,9.9 97.8,11.6 97.6,11.6 97.6,11.3 97.4,11.1 96.9,11.1 96.6,11.4 96.6,11.8 96.1,11.8 96.1,10.1 96.3,10.1 96.7,10.5 97.1,10.5 97.1,9.9
  pour Bottom (isolate 0.102, no thermals): 105.8,9.8 105.8,11.6 105.45,11.6 105.45,11.1 105.35,11 104.6,11 104.3,11.3 104.3,11.5 104.1,11.5 104.1,10 104.5,10.4 105.4,10.4 105.6,10.2 105.6,9.8
  pour Bottom (isolate 0.102, no thermals): 107.9,9.9 107.9,10.9 107.45,11.7 107.45,11.3 107.35,11.2 106.7,11.1 106.4,11.4 106.4,11.6 106.2,11.6 106.2,9.7 107.1,9.7 107,10.5 107.5,10.5 107.7,10.3 107.7,9.9
  pour Bottom (no thermals): 100.1,10.9 100.1,11.5 arc-90 100.2,11.6 102.1,11.6 102.1,10.9
  pour Top (isolate 0.2, rank 2): 56.8,20.8 94.5,20.8 94.5,15.4 89.8,15.4 88.1,12.1 85.5,9.5 76,9.5 71,14.5 56.8,14.5
  pour Bottom (isolate 0.15, rank 2): 94,16.5 93,15.5 82.9,15.2 82.9,15 76.9,15 76.7,15.2 76.5,15 75,16.5 8.1,16.5 5.3,13.7 2.6,13.7 0.4,15.9 0.4,18.6 2.6,20.8 94,20.8
  pour Top (isolate 0.18, rank 3): 0.5,15.1 0.5,20.8 47.3,20.8 47.3,15.1
  pour Top (isolate 0.15, rank 3): 101.1,20.8 101.1,11.2 130.7,11.2 133.1,13.6 133.1,20.8
  pour Top (no thermals): 82.25,17.75 82.25,17.65 82.6,17.3 83.3,17.3 83.9,17.9 83.9,18.3 83.2,18.3 82.65,17.75
HOST_PERST  (via drill 0.3)
  Top 0.12: D1.A 117.2,14.6 116.9,14.3 116.9,13.4 116.45,12.95 v116.45,12.4
  Top 0.15: JP1.A48 111.5,2.9 arc-37 111.7,3.5 arc35 112,4.35 112,5.1 arc-61 112.35,5.7 arc-15 113.35,6.1 J3.A11
  Bottom 0.12: J3.A11 114.95,7.2 114.95,9.05 116.15,10.25 116.15,11.15 116.45,11.45 v116.45,12.4
HOST_WAKE  (via drill 0.3)
  Top 0.12: R1.2 116.35,13.25 v115.8,12.7
  Route15 0.2: v108.35,3.4 108.35,3.3 109.6,3.3 109.75,3.45 110.35,3.45 110.5,3.3 112.4,3.3 arc51 113.35,3.75 arc3 114.65,5.4 arc70 114.7,7.55 arc-7 J3.B11
  Bottom 0.12: v115.8,12.7 115.8,12.6 115.95,12.45 115.95,12.3 116.05,12.2 116.05,11.45 115.9,11.3 115.9,10.35 114.3,8.75 J3.B11
  Bottom 0.15: 109.15,3.15 arc-58 109.4,2.8 109.4,1.35 JP1.B46
  Bottom 0.158: 109.15,3.15 arc17 v108.35,3.4
LX
  Top 0.24: C20.2 78.7,14.5
  pour Top (isolate 0.2, no thermals): 82.1,17.25 82.1,17.15 81.15,17.15 79,14.9 79,14 77.6,14 77.6,20 79.3,20 82.05,17.25
M2_PERST  (via drill 0.3)
  Top 0.12: J1.50 9.5,18.3 9.65,18.15 21.7,18.15 v23,19.45 | J2.50 34.5,18.3 v34.75,18.05 | 117.05,19.7 117.2,19.55 D1.C | R2.1 115.75,19.95 116,20.2 116.55,20.2 117.05,19.7 | 117.05,19.7 v117.4,20.05 | v83.7,19.25 83.4,18.95 82.95,18.95 82.75,18.75 IC2.3 82.75,18.5
  Bottom 0.12: v23,19.45 24.35,19.45 24.7,19.8 25.3,19.8 25.65,19.45 28.1,19.45 29.1,18.45 29.1,18.1 29.9,17.3 32.3,17.3 32.7,17.7 32.7,18 32.95,18.25 33.35,18.25 33.6,18 33.6,17.85 33.85,17.6 34.3,17.6 v34.75,18.05 34.9,18.05 35.1,18.25 45.4,18.25 47.45,20.3 84.15,20.3 | 84.15,20.3 106.75,20.3 107.1,19.95 107.7,19.95 108.3,20.55 116.9,20.55 v117.4,20.05 | 84.15,20.3 84.15,19.65 83.75,19.25 v83.7,19.25
M2_SUSCLK  (via drill 0.3)
  Top 0.12: v32.25,18 32.1,18.15 32.1,18.8 31.8,19.1 30,19.1 J2.68 | v107.4,20.65 107.55,20.65 107.7,20.8 121.3,20.8 122.15,19.95 Y1.3
  Top 0.158: J1.68 6.64,19.36 v6.9,19.1
  Bottom 0.12: v6.9,19.1 8.7,19.1 9.35,19.75 22.55,19.75 22.7,19.9 24.45,19.9 24.6,20.05 25.4,20.05 25.75,19.7 28.2,19.7 29.35,18.55 29.35,18.2 30,17.55 31.8,17.55 v32.25,18 32.35,18 32.85,18.5 34.1,18.5 34.35,18.75 45.2,18.75 47.25,20.8 107.1,20.8 107.25,20.65 v107.4,20.65
M2_WAKE  (via drill 0.3)
  Top 0.12: J1.54 8.5,18.25 8.3,18.05 8.1,18.05 8.05,18 v7.95,18 | v33.15,17.8 33.5,18.15 J2.54 | v114.7,13.9 R1.1
  Bottom 0.12: v7.95,18 9.45,19.5 22,19.5 22.5,19 23.3,19 23.75,18.55 26.3,18.55 26.95,19.2 28,19.2 28.85,18.35 28.85,18 29.8,17.05 32.4,17.05 v33.15,17.8 33.6,17.35 34.4,17.35 35.65,18 45.5,18 46.9,19.4 48.05,19.4 48.25,19.6 50.5,19.6 | 50.5,19.6 78.9,19.6 82.9,15.6 105.5,15.6 106,15.1 107.95,15.1 109.05,14 114.6,14 v114.7,13.9 | v50.5,18 50.5,19.6
OSC_TRI_STATE
  Top 0.2: R3.1 124.9,16.6 124.05,17.45 Y1.1
PCIE_A_CLK_N
  Top 0.158: J3.A14 109.5,4.7 arc100 109.43,5.19 arc-58 108.87,6.2 108.87,8.7 arc51 108.42,9.65 arc-53 107.87,10.75 107.87,13 arc-46 108.51,14.49 108.71,14.69 108.71,14.86 IC1.15
PCIE_A_CLK_P
  Top 0.158: J3.A13 110,5.6 arc-111 109.57,5.41 arc-58 109.13,6.2 109.13,8.7 arc51 108.58,9.85 arc-54 108.13,10.75 108.13,13 arc-46 108.69,14.31 108.89,14.51 109.06,14.51 IC1.16
PCIE_A_RX0_N
  Top 0.158: JP1.A31 90.5,2.18 90.13,2.55 90.13,4.75 arc-53 90.58,5.65 arc53 91.13,6.75 91.13,7.65 arc49 90.58,8.85 arc-49 90.13,9.85 90.13,10.7 arc-90 93.5,14.07 93.58,14.07 arc-90 93.7,13.95 arc180 94.05,13.95 arc-90 94.17,14.07 100.63,14.07 arc-90 100.75,13.95 arc180 101.1,13.95 arc-90 101.22,14.07 101.3,14.07 arc-90 103.87,11.5 103.87,10.75 arc53 104.42,9.65 arc-53 104.87,8.75 arc77 105.97,7.42 arc-77 106.87,6.25 arc-53 106.42,5.35 arc-124 106,5.55 J3.A17
PCIE_A_RX0_P
  Top 0.158: JP1.A30 89.5,2.18 89.87,2.55 89.87,4.75 arc-53 90.42,5.85 arc53 90.87,6.75 90.87,7.65 arc49 90.42,8.65 arc-49 89.87,9.85 89.87,10.7 arc-90 93.5,14.33 101.3,14.33 arc-90 104.13,11.5 104.13,10.75 arc53 104.58,9.85 arc-53 105.13,8.75 arc77 106.03,7.68 arc-78 107.13,6.23 arc-52 106.58,5.15 arc84 106.5,4.75 J3.A16
PCIE_A_RX1_N
  Top 0.158: JP1.A35 94.5,2.23 94.13,2.6 94.13,4.25 arc-53 94.58,5.15 arc53 95.13,6.25 arc-90 96.25,7.37 96.73,7.37 arc-90 96.9,7.2 arc180 97.2,7.2 arc-90 97.37,7.37 98.53,7.37 arc-90 98.7,7.2 arc180 99,7.2 arc-90 99.17,7.37 99.75,7.37 arc-90 100.87,6.25 arc53 101.42,5.15 arc-84 101.5,4.75 J3.A22
PCIE_A_RX1_P
  Top 0.158: JP1.A34 93.5,2.23 93.87,2.6 93.87,4.25 arc-53 94.42,5.35 arc53 94.87,6.25 arc-90 96.25,7.63 99.75,7.63 arc-90 101.13,6.25 arc53 101.58,5.35 arc124 102,5.55 J3.A21
PCIE_A_RX2_N
  Top 0.158: JP1.A38 101.5,2.23 101.87,2.6 arc90 101.35,3.12 100.9,3.12 arc-90 99.87,4.15 99.87,4.3 arc90 99.05,5.12 99,5.12 arc28 98.46,4.99 arc-3 J3.A26
PCIE_A_RX2_P
  Top 0.158: JP1.A39 102.5,2.23 102.13,2.6 arc90 101.35,3.38 100.9,3.38 arc-90 100.13,4.15 100.13,4.3 arc90 99.05,5.38 99,5.38 arc28 98.44,5.26 arc-115 98.2,5.4 J3.A25
PCIE_A_RX3_N
  Top 0.158: JP1.A42 105.5,2.18 105.87,2.55 105.87,4.25 arc53 105.42,5.15 arc-53 104.87,6.25 104.87,6.3 arc90 103.8,7.37 102.25,7.37 arc-90 100.87,8.75 arc53 100.42,9.65 arc-53 99.87,10.75 99.87,10.8 arc90 97.8,12.87 97.67,12.87 arc90 97.5,12.7 arc-180 97.2,12.7 arc90 97.03,12.87 96.52,12.87 arc90 96.35,12.7 arc-180 96.05,12.7 arc90 95.88,12.87 95.6,12.87 arc90 94.13,11.4 94.13,10.75 arc-53 93.58,9.65 arc53 93.13,8.75 93.13,6.25 arc53 93.58,5.35 arc124 94,5.55 J3.A29
PCIE_A_RX3_P
  Top 0.158: JP1.A43 106.5,2.18 106.13,2.55 106.13,4.25 arc53 105.58,5.35 arc-53 105.13,6.25 105.13,6.3 arc90 103.8,7.63 102.25,7.63 arc-90 101.13,8.75 arc53 100.58,9.85 arc-53 100.13,10.75 100.13,10.8 arc90 97.8,13.13 95.6,13.13 arc90 93.87,11.4 93.87,10.75 arc-53 93.42,9.85 arc53 92.87,8.75 92.87,6.25 arc53 93.42,5.15 arc-84 93.5,4.75 J3.A30
PCIE_A_TX0_N
  Bottom 0.158: JP1.B30 89.5,2.23 89.87,2.6 arc23 89.68,3.35 arc-23 89.47,4.4 89.47,4.5 arc-50 90.22,6.1 arc50 90.87,7.5 arc50 90.22,8.9 arc-50 89.47,10.5 89.47,10.6 arc-90 93.2,14.33 104.7,14.33 arc-90 108.13,10.9 108.13,10.8 arc53 108.58,9.9 arc124 109,10.1 J3.B14
PCIE_A_TX0_P
  Bottom 0.158: JP1.B31 90.5,2.23 90.13,2.6 arc23 89.92,3.45 arc-23 89.73,4.4 89.73,4.5 arc-50 90.38,5.9 arc50 91.13,7.5 arc50 90.38,9.1 arc-50 89.73,10.5 89.73,10.6 arc-90 93.2,14.07 93.23,14.07 arc-90 93.4,13.9 arc180 93.8,13.9 arc-90 93.97,14.07 104.03,14.07 arc-90 104.2,13.9 arc180 104.5,13.9 arc-90 104.67,14.07 104.7,14.07 arc-90 107.87,10.9 107.87,10.8 arc53 108.42,9.7 arc-99 108.45,9.25 J3.B15
PCIE_A_TX1_N
  Bottom 0.158: JP1.B34 93.5,2.23 93.87,2.6 93.87,4.2 arc-51 94.42,5.35 arc49 94.87,6.25 arc-73 95.97,7.63 arc75 96.87,8.8 arc-55 97.43,9.86 arc55 97.87,10.7 arc-90 99.1,11.93 103,11.93 arc-90 104.13,10.8 104.13,10.75 arc-53 103.58,9.65 arc112 103.6,9.2 J3.B19
PCIE_A_TX1_P
  Bottom 0.158: JP1.B35 94.5,2.23 94.13,2.6 94.13,4.2 arc-51 94.58,5.15 arc49 95.13,6.25 arc-73 96.03,7.37 arc75 97.13,8.8 arc-55 97.57,9.64 arc55 98.13,10.7 arc-90 99.1,11.67 99.53,11.67 arc-90 99.7,11.5 arc180 100,11.5 arc-90 100.17,11.67 101.73,11.67 arc-90 101.9,11.5 arc180 102.3,11.5 arc-90 102.47,11.67 103,11.67 arc-90 103.87,10.8 103.87,10.75 arc-53 103.42,9.85 arc-123 103.1,10 J3.B20
PCIE_A_TX2_N
  Bottom 0.158: J3.B24 99.5,10.25 arc-84 99.42,9.85 arc53 98.87,8.75 arc77 99.97,7.37 arc-77 100.87,6.25 arc53 101.42,5.15 arc-53 101.87,4.25 101.87,2.6 101.5,2.23 JP1.B38
PCIE_A_TX2_P
  Bottom 0.158: J3.B23 100,9.45 arc124 99.58,9.65 arc54 99.13,8.74 arc77 100.03,7.63 arc-77 101.13,6.25 arc53 101.58,5.35 arc-53 102.13,4.25 102.13,2.6 102.5,2.23 JP1.B39
PCIE_A_TX3_N
  Bottom 0.158: JP1.B43 106.5,2.13 106.87,2.5 arc61 106.44,3.24 arc-61 105.87,4.2 105.87,4.25 arc-53 106.42,5.35 arc53 106.87,6.25 106.87,8.75 arc53 106.42,9.65 arc-53 105.87,10.75 105.87,10.85 arc90 103.85,12.87 103.77,12.87 arc90 103.6,12.7 arc-180 103.2,12.7 arc90 103.03,12.87 98.87,12.87 arc90 98.7,12.7 arc-180 98.4,12.7 arc90 98.23,12.87 98.15,12.87 arc90 96.13,10.85 96.13,10.8 arc-53 95.58,9.7 arc99 95.55,9.25 J3.B27
PCIE_A_TX3_P
  Bottom 0.158: JP1.B44 107.5,2.13 107.13,2.5 arc61 106.56,3.46 arc-61 106.13,4.2 106.13,4.25 arc-53 106.58,5.15 arc53 107.13,6.25 107.13,8.75 arc53 106.58,9.85 arc-53 106.13,10.75 106.13,10.85 arc90 103.85,13.13 98.15,13.13 arc90 95.87,10.85 95.87,10.8 arc-53 95.42,9.9 arc-124 95,10.1 J3.B28
PCIE_AB_CLK_N
  Top 0.158: JP1.A45 108.5,2.03 108.87,2.4 108.87,2.5 arc-64 109.44,3.42 arc64 109.87,4.1 109.87,4.2 arc-51 110.42,5.35 arc51 110.87,6.3 arc30 110.74,6.78 arc-33 110.57,7.45 110.57,7.6 arc-31 110.74,8.22 113.49,12.57 arc76 113.31,14.01 112.46,14.86 112.3,14.86 IC1.22
PCIE_AB_CLK_P
  Top 0.158: JP1.A46 109.5,2.03 109.13,2.4 109.13,2.5 arc-64 109.56,3.18 arc64 110.13,4.1 110.13,4.2 arc-51 110.58,5.15 arc51 111.13,6.3 arc31 110.96,6.92 arc-33 110.83,7.45 110.83,7.6 arc-31 110.96,8.08 113.71,12.43 arc76 113.49,14.19 112.64,15.04 112.64,15.22 IC1.23
PCIE_B_CLK_N  (via drill 0.3)
  Top 0.158: J2.53 33.75,15.42 33.63,15.3 33.63,14.55 v33.83,14.55 | v86.1,8.17 86.1,8.37 86.4,8.37 arc90 88.73,10.7 88.73,11.4 arc-90 92.6,15.27 106.1,15.27 arc-35 106.56,15.11 arc90 108.09,15.11 108.29,15.31 108.45,15.31 IC1.14
  Bottom 0.158: v33.83,14.55 33.63,14.55 33.63,14.9 arc-90 35.5,16.77 45.5,16.77 arc-29 47.94,16.14 arc29 50.5,15.47 66.5,15.47 arc-46 74.81,11.91 75.11,11.61 arc46 83.1,8.37 86.1,8.37 v86.1,8.17
PCIE_B_CLK_P  (via drill 0.3)
  Top 0.158: J2.55 33.25,15.42 33.37,15.3 33.37,14.55 v33.17,14.55 | v86.1,8.83 86.1,8.63 86.4,8.63 arc90 88.47,10.7 88.47,11.4 arc-90 92.6,15.53 106.1,15.53 arc-40 106.74,15.29 arc90 107.91,15.29 108.11,15.49 108.11,15.68 IC1.13
  Bottom 0.158: v33.17,14.55 33.37,14.55 33.37,14.9 arc-90 35.5,17.03 45.5,17.03 arc-29 48.06,16.36 arc29 50.5,15.73 66.5,15.73 arc-46 74.99,12.09 | 74.99,12.09 | 74.99,12.09 75.28,11.8 arc46 83.1,8.63 86.1,8.63 v86.1,8.83
PCIE_B_CLKREQ  (via drill 0.3)
  Top 0.12: J2.52 34,18.35 34.05,18.3 v34.05,18.05 | R8.1 116.3,16.5 116.5,16.7 116.5,17.4 117.4,18.3 118.8,18.3 | 118.8,18.3 T1.1 | 118.8,18.3 120.3,18.3 120.5,18.5 120.5,19.6 120.3,19.8 119.2,19.8 v118.7,20.3
  Bottom 0.12: v34.05,18.05 34.5,18.5 45.3,18.5 47.35,20.55 106.85,20.55 107.2,20.2 107.6,20.2 108.2,20.8 118.2,20.8 v118.7,20.3
PCIE_B_RX0_N
  Top 0.158: J2.43 36.25,15.42 36.37,15.3 arc90 41.1,10.57 65.83,10.57 arc-90 66,10.4 arc180 66.3,10.4 arc-90 66.47,10.57 66.5,10.57 arc-44 71.31,8.61 76.51,3.41 arc-46 76.87,2.6 76.5,2.23 JP1.A17
PCIE_B_RX0_P
  Top 0.158: J2.41 36.75,15.42 36.63,15.3 arc90 41.1,10.83 41.23,10.83 arc90 41.4,11 arc-180 41.7,11 arc90 41.87,10.83 66.5,10.83 arc-44 71.49,8.79 76.69,3.59 arc-46 77.13,2.6 77.5,2.23 JP1.A18
PCIE_B_RX1_N
  Top 0.158: J2.31 39.25,15.42 39.37,15.3 39.37,14 arc90 41.6,11.77 65.83,11.77 arc-90 66,11.6 arc180 66.3,11.6 arc-90 66.47,11.77 66.5,11.77 arc-44 72.16,9.46 76.01,5.61 arc45 77.3,5.07 77.5,5.07 arc-90 79.87,2.7 79.87,2.6 79.5,2.23 JP1.A20
PCIE_B_RX1_P
  Top 0.158: J2.29 39.75,15.42 39.63,15.3 39.63,14 arc90 41.6,12.03 41.63,12.03 arc90 41.8,12.2 arc-180 42.1,12.2 arc90 42.27,12.03 66.5,12.03 arc-44 72.34,9.64 76.19,5.79 arc45 77.3,5.33 77.5,5.33 arc-90 80.13,2.7 80.13,2.6 80.5,2.23 JP1.A21
PCIE_B_RX2_N
  Top 0.158: J2.19 42.25,15.42 42.37,15.3 arc90 44.7,12.97 65.83,12.97 arc-90 66,12.8 arc180 66.3,12.8 arc-90 66.47,12.97 66.5,12.97 arc-44 73.01,10.31 76.41,6.91 arc46 78,6.27 79,6.27 arc-90 82.87,2.6 82.5,2.23 JP1.A23
PCIE_B_RX2_P
  Top 0.158: J2.17 42.75,15.42 42.63,15.3 arc90 44.7,13.23 44.73,13.23 arc90 44.9,13.4 arc-180 45.2,13.4 arc90 45.37,13.23 66.5,13.23 arc-45 73.19,10.49 76.59,7.09 arc46 78,6.53 79,6.53 arc-90 83.13,2.6 83.5,2.23 JP1.A24
PCIE_B_RX3_N
  Top 0.158: J2.5 45.75,15.42 45.63,15.3 arc90 46.5,14.43 46.53,14.43 arc90 46.7,14.6 arc-180 47,14.6 arc90 47.17,14.43 66.5,14.43 arc-45 74.04,11.34 77.09,8.29 arc48 78.3,7.83 81.6,7.83 arc-90 86.13,3.3 86.13,2.6 86.5,2.23 JP1.A27
PCIE_B_RX3_P
  Top 0.158: J2.7 45.25,15.42 45.37,15.3 arc90 46.5,14.17 65.83,14.17 arc-90 66,14 arc180 66.3,14 arc-90 66.47,14.17 66.5,14.17 arc-45 73.86,11.16 | JP1.A26 85.5,2.23 85.87,2.6 85.87,3.3 arc90 81.6,7.57 78.3,7.57 arc-48 76.91,8.11 73.86,11.16 | 73.86,11.16
PCIE_B_TX0_N  (via drill 0.3)
  Top 0.158: J2.49 34.75,15.42 34.87,15.3 34.87,14.3 arc45 36.11,11.31 36.31,11.11 v36.17,10.97
  Bottom 0.158: JP1.B16 75.5,2.23 75.87,2.6 75.87,2.7 arc45 74.91,5.01 71.31,8.61 arc44 66.5,10.57 66.47,10.57 arc90 66.3,10.4 arc-180 66,10.4 arc90 65.83,10.57 37.45,10.57 arc-47 36.46,10.96 36.31,11.11 v36.17,10.97
PCIE_B_TX0_P  (via drill 0.3)
  Top 0.158: J2.47 35.25,15.42 35.13,15.3 35.13,14.3 arc45 36.3,11.49 36.49,11.29 v36.63,11.43
  Bottom 0.158: JP1.B17 76.5,2.23 76.13,2.6 76.13,2.7 arc45 75.09,5.19 71.49,8.79 arc44 66.5,10.83 38.17,10.83 arc-90 38,11 arc180 37.7,11 arc-90 37.53,10.83 37.45,10.83 arc-47 36.64,11.14 36.49,11.29 v36.63,11.43
PCIE_B_TX1_N  (via drill 0.3)
  Top 0.158: J2.37 37.75,15.42 37.87,15.3 37.87,14.55 v37.67,14.55
  Bottom 0.158: v37.67,14.55 37.87,14.55 37.87,13.4 arc90 39,12.27 40.4,12.27 arc-30 41.84,11.89 arc30 43.4,11.47 46.2,11.47 arc20 47.25,11.63 arc-20 48.2,11.77 65.83,11.77 arc-90 66,11.6 arc180 66.3,11.6 arc-90 66.47,11.77 66.5,11.77 arc-44 72.16,9.46 75.51,6.11 arc45 77.15,5.42 arc-90 78.87,3.7 78.87,2.6 78.5,2.23 JP1.B19
PCIE_B_TX1_P  (via drill 0.3)
  Top 0.158: J2.35 38.25,15.42 38.13,15.3 38.13,14.55 v38.33,14.55
  Bottom 0.158: v38.33,14.55 38.13,14.55 38.13,14.12 arc90 38.3,13.95 arc-180 38.3,13.65 arc90 38.13,13.48 38.13,13.4 arc90 39,12.53 40.4,12.53 arc-30 41.97,12.11 arc30 43.4,11.73 46.2,11.73 arc20 47.15,11.87 arc-20 48.2,12.03 66.5,12.03 arc-44 72.34,9.64 75.69,6.29 arc44 77.15,5.68 arc-90 79.13,3.7 79.13,2.6 79.5,2.23 JP1.B20
PCIE_B_TX2_N  (via drill 0.3)
  Top 0.158: J2.25 40.75,15.42 40.87,15.3 40.87,14.55 v40.67,14.55
  Bottom 0.158: v40.67,14.55 40.87,14.55 40.87,14.2 arc90 42.1,12.97 65.83,12.97 arc-90 66,12.8 arc180 66.3,12.8 arc-90 66.47,12.97 66.5,12.97 arc-44 73.01,10.31 75.91,7.41 arc44 77.9,6.57 78.4,6.57 arc-90 81.87,3.1 81.87,2.6 81.5,2.23 JP1.B22
PCIE_B_TX2_P  (via drill 0.3)
  Top 0.158: J2.23 41.25,15.42 41.13,15.3 41.13,14.55 v41.33,14.55
  Bottom 0.158: v41.33,14.55 41.13,14.55 41.13,14.2 arc90 42.1,13.23 42.23,13.23 arc90 42.4,13.4 arc-180 42.7,13.4 arc90 42.87,13.23 66.5,13.23 arc-45 73.19,10.49 76.09,7.59 arc44 77.9,6.83 78.4,6.83 arc-90 82.13,3.1 82.13,2.6 82.5,2.23 JP1.B23
PCIE_B_TX3_N  (via drill 0.3)
  Top 0.158: J2.11 44.25,15.42 44.13,15.3 44.13,14.55 v44.33,14.55
  Bottom 0.158: JP1.B25 84.5,2.23 84.87,2.6 84.87,3.2 arc90 80.5,7.57 arc-45 75.31,9.71 73.86,11.16 arc45 66.5,14.17 66.47,14.17 arc90 66.3,14 arc-180 66,14 arc90 65.83,14.17 49.5,14.17 arc-39 47.42,14.9 arc39 45.5,15.57 44.9,15.57 arc90 44.13,14.8 44.13,14.55 v44.33,14.55
PCIE_B_TX3_P  (via drill 0.3)
  Top 0.158: J2.13 43.75,15.42 43.87,15.3 43.87,14.55 v43.67,14.55
  Bottom 0.158: JP1.B26 85.5,2.23 85.13,2.6 85.13,3.2 arc90 80.5,7.83 arc-45 75.49,9.9 74.04,11.34 arc45 66.5,14.43 49.5,14.43 arc-39 47.58,15.1 arc39 45.5,15.83 44.9,15.83 arc90 43.87,14.8 43.87,14.55 v43.67,14.55
PCIE_C_CLK_N  (via drill 0.3)
  Top 0.158: JP1.A14 73.5,2.23 73.87,2.6 73.87,3.7 arc45 73.41,4.81 70.46,7.76 arc44 66.5,9.37 66.47,9.37 arc90 66.3,9.2 arc-180 66,9.2 arc90 65.83,9.37 37.35,9.37 arc-46 32.11,11.51 31.91,11.71 v31.77,11.57 | J1.53 8.75,15.42 8.63,15.3 8.63,14.55 v8.83,14.55
  Bottom 0.158: v31.77,11.57 31.91,11.71 28.41,15.21 arc44 25.2,16.57 22.7,16.57 arc-46 20.61,17.41 20.21,17.81 arc46 19.3,18.17 14,18.17 arc48 12.1,17.31 arc-48 10,16.37 9.9,16.37 arc90 8.63,15.1 8.63,14.55 v8.83,14.55
PCIE_C_CLK_P  (via drill 0.3)
  Top 0.158: JP1.A15 74.5,2.23 74.13,2.6 74.13,3.7 arc45 73.59,4.99 70.64,7.94 arc44 66.5,9.63 37.35,9.63 arc-46 32.3,11.69 32.09,11.89 v32.23,12.03 | J1.55 8.25,15.42 8.37,15.3 8.37,14.55 v8.17,14.55
  Bottom 0.158: v32.23,12.03 32.09,11.89 28.59,15.39 arc44 25.2,16.83 22.7,16.83 arc-46 20.8,17.59 20.39,17.99 arc46 19.3,18.43 14,18.43 arc48 11.9,17.49 arc-48 10,16.63 9.9,16.63 arc90 8.37,15.1 8.37,14.55 v8.17,14.55
PCIE_C_CLKREQ  (via drill 0.3)
  Top 0.12: J1.52 9,18.1 v8.6,17.7
  Bottom 0.12: JP1.B14 73.5,3.8 arc44 72.6,5.9 70.6,7.9 arc43 66.5,9.5 36.3,9.5 arc-57 35.2,10.1 arc-2 34.35,11.45 arc12 32.5,13.75 29.65,16.6 29.65,16.8 28.6,17.85 28.6,18.25 27.95,18.9 27,18.9 26.4,18.3 23.6,18.3 23.15,18.75 22.4,18.75 21.9,19.25 9.55,19.25 8.6,18.3 v8.6,17.7
PCIE_C_RX0_N  (via drill 0.3)
  Top 0.158: J1.41 11.75,15.42 11.63,15.3 11.63,14.55 v11.83,14.55
  Bottom 0.158: JP1.B11 70.5,2.23 70.87,2.6 70.87,3.4 arc90 66.1,8.17 66.07,8.17 arc90 65.9,8 arc-180 65.6,8 arc90 65.43,8.17 36.2,8.17 arc-44 30.91,10.41 27.71,13.61 arc45 26.1,14.27 23.7,14.27 arc-49 22.4,14.87 arc49 21.3,15.37 13.27,15.37 arc90 13.1,15.2 arc-180 12.8,15.2 arc90 12.63,15.37 12.2,15.37 arc90 11.63,14.8 11.63,14.55 v11.83,14.55
PCIE_C_RX0_P  (via drill 0.3)
  Top 0.158: J1.43 11.25,15.42 11.37,15.3 11.37,14.55 v11.17,14.55
  Bottom 0.158: JP1.B12 71.5,2.23 71.13,2.6 71.13,3.4 arc90 66.1,8.43 36.2,8.43 arc-44 31.1,10.59 27.88,13.8 arc45 26.1,14.53 23.7,14.53 arc-49 22.6,15.04 arc49 21.3,15.63 12.2,15.63 arc90 11.37,14.8 11.37,14.55 v11.17,14.55
PCIE_C_RX1_N  (via drill 0.3)
  Top 0.158: JP1.A11 70.5,2.23 70.87,2.6 70.87,3.8 arc90 66.5,8.17 66.47,8.17 arc90 66.3,8 arc-180 66,8 arc90 65.83,8.17 28.2,8.17 arc-44 24.31,9.81 24.01,10.11 v23.87,9.97 | J1.31 14.25,15.42 14.37,15.3 14.37,12.8 v14.17,12.8
  Bottom 0.158: v14.17,12.8 14.37,12.8 14.37,12.5 arc90 15.4,11.47 16.1,11.47 arc31 17.07,11.74 arc-31 17.9,11.97 19.9,11.97 arc-45 23.71,10.41 24.01,10.11 v23.87,9.97
PCIE_C_RX1_P  (via drill 0.3)
  Top 0.158: JP1.A12 71.5,2.23 71.13,2.6 71.13,3.8 arc90 66.5,8.43 28.2,8.43 arc-44 24.5,9.99 24.19,10.29 v24.33,10.43 | J1.29 14.75,15.42 14.63,15.3 14.63,12.8 v14.83,12.8
  Bottom 0.158: v14.83,12.8 14.63,12.8 14.63,12.5 arc90 15.4,11.73 15.43,11.73 arc90 15.6,11.9 arc-180 15.9,11.9 arc90 16.07,11.73 16.1,11.73 arc31 16.93,11.96 arc-31 17.9,12.23 19.9,12.23 arc-45 23.89,10.59 24.19,10.29 v24.33,10.43
PCIE_C_RX2_N
  Top 0.158: JP1.A9 68.5,2.23 68.13,2.6 68.13,3.4 arc90 64.3,7.23 23.5,7.23 arc-55 21.1,8.38 arc53 18.6,9.63 arc-90 17.63,10.6 17.63,10.63 arc-90 17.8,10.8 arc180 17.8,11.1 arc-90 17.63,11.27 17.63,15.3 17.75,15.42 J1.17
PCIE_C_RX2_P
  Top 0.158: JP1.A8 67.5,2.23 67.87,2.6 67.87,3.4 arc90 64.3,6.97 64.27,6.97 arc90 64.1,6.8 arc-180 63.8,6.8 arc90 63.63,6.97 23.5,6.97 arc-55 20.9,8.22 arc53 18.6,9.37 arc-90 17.37,10.6 17.37,15.3 17.25,15.42 J1.19
PCIE_C_RX3_N  (via drill 0.3)
  Top 0.158: J1.7 20.25,15.42 20.37,15.3 20.37,14.5 arc90 20.95,13.92 22.65,13.92 arc-45 26.81,12.21 28.61,10.41 v28.47,10.27
  Bottom 0.158: JP1.B8 67.5,2.23 67.87,2.6 67.87,3.4 arc90 64.3,6.97 64.27,6.97 arc90 64.1,6.8 arc-180 63.8,6.8 arc90 63.63,6.97 33.7,6.97 arc-46 30.91,8.11 28.61,10.41 v28.47,10.27
PCIE_C_RX3_P  (via drill 0.3)
  Top 0.158: J1.5 20.75,15.42 20.63,15.3 20.63,14.5 arc90 20.95,14.18 20.98,14.18 arc90 21.1,14.3 arc-180 21.4,14.3 arc90 21.52,14.18 22.65,14.18 arc-45 26.99,12.39 28.79,10.59 v28.93,10.73
  Bottom 0.158: JP1.B9 68.5,2.23 68.13,2.6 68.13,3.4 arc90 64.3,7.23 33.7,7.23 arc-46 31.1,8.29 28.79,10.59 v28.93,10.73
PCIE_C_TX0_N  (via drill 0.3)
  Top 0.158: J1.49 9.75,15.42 9.87,15.3 9.87,13.65 arc90 10.8,12.72 11,12.72 v11,12.52
  Bottom 0.158: JP1.B5 64.5,2.23 64.87,2.6 64.87,3.4 arc90 62.5,5.77 62.47,5.77 arc90 62.3,5.6 arc-180 62,5.6 arc90 61.83,5.77 32.3,5.77 arc-46 29.51,6.91 23.31,13.11 arc46 20.8,14.12 15.5,14.12 arc39 13.58,13.45 arc-39 11.5,12.72 11,12.72 v11,12.52
PCIE_C_TX0_P  (via drill 0.3)
  Top 0.158: J1.47 10.25,15.42 10.13,15.3 10.13,14.37 arc90 10.3,14.2 arc-180 10.3,13.9 arc90 10.13,13.73 10.13,13.65 arc90 10.8,12.98 11,12.98 v11,13.18
  Bottom 0.158: JP1.B6 65.5,2.23 65.13,2.6 65.13,3.4 arc90 62.5,6.03 32.3,6.03 arc-46 29.7,7.09 23.49,13.29 arc46 20.8,14.38 15.5,14.38 arc39 13.42,13.65 arc-39 11.5,12.98 11,12.98 v11,13.18
PCIE_C_TX1_N
  Top 0.158: JP1.A5 64.5,2.23 64.87,2.6 64.87,3.4 arc90 62.5,5.77 62.47,5.77 arc90 62.3,5.6 arc-180 62,5.6 arc90 61.83,5.77 18.4,5.77 arc-90 12.87,11.3 12.87,15.3 12.75,15.42 J1.37
PCIE_C_TX1_P
  Top 0.158: JP1.A6 65.5,2.23 65.13,2.6 65.13,3.4 arc90 62.5,6.03 18.4,6.03 arc-90 13.13,11.3 13.13,11.33 arc-90 13.3,11.5 arc180 13.3,11.8 arc-90 13.13,11.97 13.13,15.3 13.25,15.42 J1.35
PCIE_C_TX2_N  (via drill 0.3)
  Top 0.158: J1.25 15.75,15.42 15.87,15.3 15.87,11.78 arc44 17.01,9.21 18.81,7.41 v18.67,7.27
  Bottom 0.158: JP1.B2 61.5,2.23 61.87,2.6 61.87,3.4 arc90 60.7,4.57 60.67,4.57 arc90 60.5,4.4 arc-180 60.2,4.4 arc90 60.03,4.57 23.4,4.57 arc-45 20.41,5.81 18.81,7.41 v18.67,7.27
PCIE_C_TX2_P  (via drill 0.3)
  Top 0.158: J1.23 16.25,15.42 16.13,15.3 16.13,12.47 arc90 16.3,12.3 arc-180 16.3,12 arc90 16.13,11.83 16.13,11.8 arc44 17.19,9.4 18.99,7.59 v19.13,7.73
  Bottom 0.158: JP1.B3 62.5,2.23 62.13,2.6 62.13,3.4 arc90 60.7,4.83 23.4,4.83 arc-45 20.59,6 18.99,7.59 v19.13,7.73
PCIE_C_TX3_N  (via drill 0.3)
  Top 0.158: JP1.A2 61.5,2.23 61.87,2.6 61.87,3.4 arc90 60.7,4.57 60.67,4.57 arc90 60.5,4.4 arc-180 60.2,4.4 arc90 60.03,4.57 19,4.57 v19,4.37 | J1.13 18.75,15.42 18.87,15.3 18.87,11.1 v18.67,11.1
  Bottom 0.158: v18.67,11.1 18.87,11.1 18.87,10.8 arc-41 18.15,8.88 arc41 17.37,6.8 17.37,5.9 arc90 18.7,4.57 19,4.57 v19,4.37
PCIE_C_TX3_P  (via drill 0.3)
  Top 0.158: JP1.A3 62.5,2.23 62.13,2.6 62.13,3.4 arc90 60.7,4.83 19,4.83 v19,5.03 | J1.11 19.25,15.42 19.13,15.3 19.13,11.1 v19.33,11.1
  Bottom 0.158: v19.33,11.1 19.13,11.1 19.13,10.8 arc-41 18.35,8.71 arc41 17.63,6.8 17.63,6.57 arc90 17.8,6.4 arc-180 17.8,6.1 arc90 17.63,5.93 17.63,5.9 arc90 18.7,4.83 19,4.83 v19,5.03
SMBCLK  (via drill 0.3)
  Top 0.12: IC1.19 110.95,14.05 111.1,13.9 110.85,13.65 110.85,13.35 110.7,13.2 110.7,12.25 v110.75,12.2 | v117.5,7.2 117.15,7.2 116.9,7.45 116.9,9.2 115.85,10.25 115.85,11.1 115.15,11.8 v115.15,12.7
  Bottom 0.12: JP1.B53 116.5,2.2 116.1,2.6 116.1,4.6 117.15,5.65 117.15,6.85 v117.5,7.2 | v115.15,12.7 115.1,12.7 114.9,12.5 113.35,12.5 112.5,13.35 111.2,13.35 110.75,12.9 v110.75,12.2
SMBDAT  (via drill 0.3)
  Top 0.12: IC1.20 111.65,14.09 111.65,13.95 111.1,13.4 111.1,13.25 110.94,13.09 110.94,12.66 111.4,12.2 v111.45,12.2 | v115.6,12 116.1,11.5 116.1,10.4 117.15,9.35 117.15,8.15 117.35,7.95 v117.35,7.85
  Bottom 0.12: JP1.B52 115.5,2.15 115.85,2.5 115.85,4.7 116.9,5.75 116.9,7.4 v117.35,7.85 | v111.45,12.2 111.5,12.25 115.35,12.25 v115.6,12
VCC  (via drill 0.3)
  Top 0.158: 72,20.75 72,20.8
  Top 0.16: v83.7,19.87 83.07,20.5 C5.1 R5.2
  Top 0.2: 6.7,15.45 6.65,15.45
  Top 0.3: J1.2 v21.5,20.7 | 21,19.8 J1.4 21,20.7 | J1.12 v19,20.7 | 18.5,19.8 J1.14 18.5,20.7 | J1.16 v18,20.7 | 17.5,19.8 J1.18 17.5,20.7 | J1.70 v4.5,20.65 | J1.72 4,19.7 | 3.5,19.7 J1.74 v3.5,20.65 | 46,19.6 J2.4 46,20.7 | 46.5,19.6 J2.2 v46.5,20.7 | 44,19.6 J2.12 v44,20.7 | 43.5,19.6 J2.14 43.5,20.7 | 42.5,19.6 J2.18 42.5,20.7 | J2.74 v28.5,20.7 | 29,19.8 J2.72 29,20.7 | J2.70 v29.5,20.7 | J1.72 4,20.1 | J1.72 4,20.65 | J2.16 v43,20.7
  Top 0.5: C10.1 6.7,15.45 v6.95,15.45 | 6.65,15.45 v6.3,15.45
  Bottom 0.12: v83.7,19.87 83.7,19.95 | 47.75,19.95 v47.75,19.85
  Bottom 0.32: 83.7,19.95 47.75,19.95
  Bottom 0.5: v28.5,20.7 v29.5,20.7 v30.5,20.7
  other vias: 5.5,20.65 63.5,19.1 7,20.6 62.7,19.1 61.9,19.1 60.3,19.1 58.7,19.1 61.1,19.1 59.5,19.1 59.1,18.6 59.9,18.6 60.7,18.6 61.5,18.6 62.3,18.6 63.1,18.6
  pour Top (isolate 0.2): 3.4,20.8 3.4,19.3 63.8,19.3 63.8,20.8
  pour Route2 (isolate 0.16): 3.4,21 3.4,20.15 4.65,18.9 5.8,18.9 6.7,18 29.5,18 30,18.5 31.7,18.5 32.4,17.8 62.8,17.8 63.9,18.9 63.9,21
  pour Route15 (isolate 0.16): 3.4,21 3.4,19.8 5.2,16.4 6.35,15.25 6.95,15.25 13.9,18.3 18.3,18.3 22.4,19.4 26,19.4 27.8,17.7 63.8,17.7 63.8,21
  pour Top (no thermals): 58.3,20.8 58.1,19.35 59.05,18.4 63.2,18.4 64.1,19.3 71.1,19.3 73.6,16.8 74.4,16.8 74.4,20.8
VCCINT  (via drill 0.3)  (1 unrouted)
  Top 0.16: C13.1 v121.65,16
  Top 0.2: R3.2 122.6,15.1 122.3,15.4 C13.1
  Top 0.24: Y1.4 122.3,17.55 C13.1
  Top 0.4: JP1.A50 113.3,1.45 113.3,4.45 v112.6,5.15 | v112.95,9 112.95,9.15 113.55,9.75 114,9.75 J3.B10
  Route15 0.32: 115,10.7 115.7,11.4
  Bottom 0.36: 110.7,3.15 110,3.85
  Bottom 0.4: JP1.B47 110.7,1.45 110.7,3.15 | 110,3.85 110,4.75 110.7,5.45 111.05,5.45 | v112.6,5.15 112.3,5.45 111.05,5.45 | v112.95,9 112.35,9 arc90 110.85,7.5 arc11 110.95,6.5 arc-12 111.05,5.45
  pour Route15 (isolate 0.12): 114.6,11.1 114.6,12.6 116.55,14.55 116.55,15.65 118.15,15.65 119.9,17.4 121.3,17.4 122,16.7 122,16 117.3,11.3 115.6,11.3 115,10.7

## Text on the board
tPlace: J1 | J2 | Dual M.2 Riser | j4cbo 20241019 | IC1 | J3
bPlace: JLCJLCJLC